# Altium schematic sheet soc.SchDoc
size A3; SheetNumber: 2; SheetTotal: 8
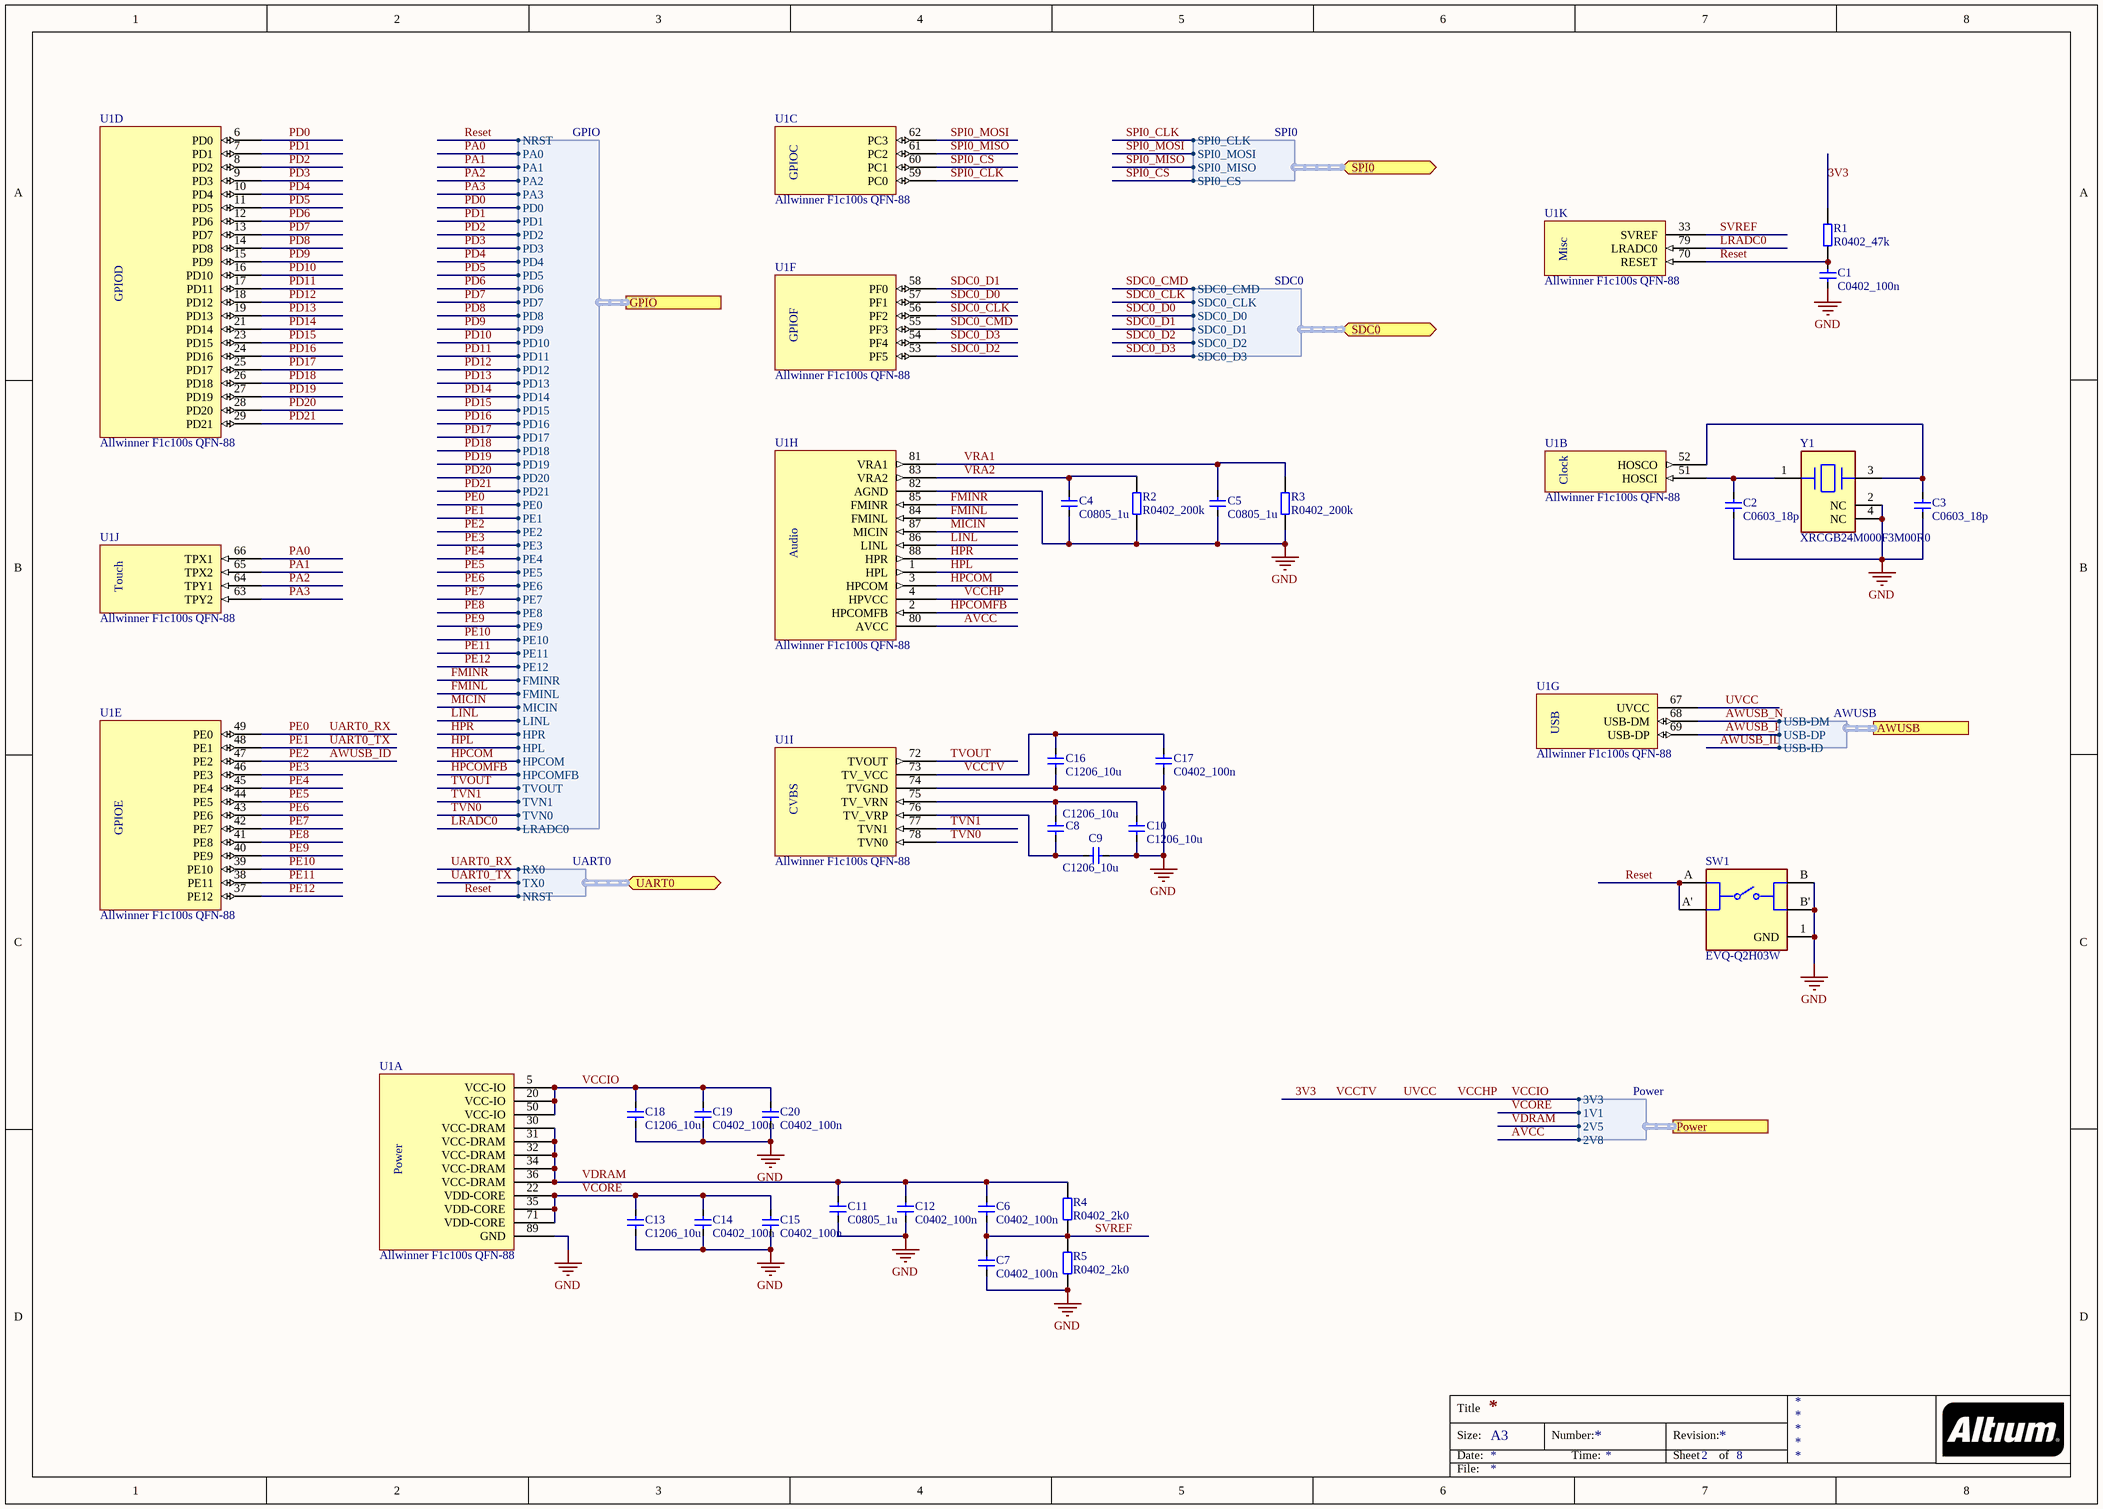
[diagram p0: soc.SchDoc]

## Parts
C1  C0402_100n  [C0402]
C2  C0603_18p  [C0603]
C3  C0603_18p  [C0603]
C4  C0805_1u  [C0805]
C5  C0805_1u  [C0805]
C6  C0402_100n  [C0402]
C7  C0402_100n  [C0402]
C8  C1206_10u  [C1206]
C9  C1206_10u  [C1206]
C10  C1206_10u  [C1206]
C11  C0805_1u  [C0805]
C12  C0402_100n  [C0402]
C13  C1206_10u  [C1206]
C14  C0402_100n  [C0402]
C15  C0402_100n  [C0402]
C16  C1206_10u  [C1206]
C17  C0402_100n  [C0402]
C18  C1206_10u  [C1206]
C19  C0402_100n  [C0402]
C20  C0402_100n  [C0402]
R1  R0402_47k  [R0402]
R2  R0402_200k  [R0402]
R3  R0402_200k  [R0402]
R4  R0402_2k0  [R0402]
R5  R0402_2k0  [R0402]
SW1  EVQ-Q2H03W  [FP-EVQ-Q2H03W-MFG]
U1  Allwinner F1c100s QFN-88  [QFN40P1000X1000X90_HS-89M]  (parts A,B,C,D,E,F,G,H,I,J,K of 11)
Y1  XRCGB24M000F3M00R0  [FP-XRCGB_F_N-MFG]

## Ports
AWUSB (harness AWUSB), GPIO (harness GPIO), Power (harness Power), SDC0 (bidir, harness SDC0), SPI0 (bidir, harness SPI0), UART0 (bidir, harness UART0)

## Harnesses
Power: 3V3, 1V1, 2V5, 2V8
AWUSB: USB-DM, USB-DP, USB-ID
SDC0: SDC0_D0, SDC0_D1, SDC0_D2, SDC0_D3, SDC0_CMD, SDC0_CLK
SPI0: SPI0_CLK, SPI0_MOSI, SPI0_MISO, SPI0_CS
UART0: RX0, TX0, NRST
GPIO: PA0, PA1, PA2, PA3, PD0, PD1, PD2, PD3, PD4, PD5, PD6, PD7, PD8, PD9, PD10, PD11, PD12, PD13, PD14, PD15, PD16, PD17, PD18, PD19, PD20, PD21, PE0, PE1, PE2, PE3, PE4, PE5, PE6, PE7, PE8, PE9, PE10, PE11, PE12, NRST, FMINR, FMINL, MICIN, LINL, HPR, HPL, HPCOM, HPCOMFB, TVOUT, TVN0, TVN1, LRADC0

## Nets
GND: C1.2 C2.2 C3.2 C4.2 C5.2 C7.2 C9.2 C10.2 C11.2 C12.2 C13.2 C14.2 C15.2 C16.2 C17.2 C18.2 C19.2 C20.2 R2.1 R3.1 R5.2 SW1.1(GND) SW1.B SW1.B' U1.74(TVGND) U1.82(AGND) U1.89(GND) Y1.2(NC) Y1.4(NC)
3V3: C16.1 C17.1 C18.1 C19.1 C20.1 R1.2 U1.4(HPVCC) U1.5(VCC-IO) U1.20(VCC-IO) U1.50(VCC-IO) U1.67(UVCC) U1.73(TV_VCC) ; port Power.3V3  [also labelled UVCC, VCCHP, VCCIO, VCCTV]
AVCC: U1.80(AVCC) ; port Power.2V8
AWUSB_ID: U1.47(PE2) ; port AWUSB.USB-ID, port GPIO.PE2  [also labelled PE2]
AWUSB_N: U1.68(USB-DM) ; port AWUSB.USB-DM
AWUSB_P: U1.69(USB-DP) ; port AWUSB.USB-DP
FMINL: U1.84(FMINL) ; port GPIO.FMINL
FMINR: U1.85(FMINR) ; port GPIO.FMINR
HPCOM: U1.3(HPCOM) ; port GPIO.HPCOM
HPCOMFB: U1.2(HPCOMFB) ; port GPIO.HPCOMFB
HPL: U1.1(HPL) ; port GPIO.HPL
HPR: U1.88(HPR) ; port GPIO.HPR
LINL: U1.86(LINL) ; port GPIO.LINL
LRADC0: U1.79(LRADC0) ; port GPIO.LRADC0
MICIN: U1.87(MICIN) ; port GPIO.MICIN
PA0: U1.66(TPX1) ; port GPIO.PA0
PA1: U1.65(TPX2) ; port GPIO.PA1
PA2: U1.64(TPY1) ; port GPIO.PA2
PA3: U1.63(TPY2) ; port GPIO.PA3
PD0: U1.6(PD0) ; port GPIO.PD0
PD1: U1.7(PD1) ; port GPIO.PD1
PD2: U1.8(PD2) ; port GPIO.PD2
PD3: U1.9(PD3) ; port GPIO.PD3
PD4: U1.10(PD4) ; port GPIO.PD4
PD5: U1.11(PD5) ; port GPIO.PD5
PD6: U1.12(PD6) ; port GPIO.PD6
PD7: U1.13(PD7) ; port GPIO.PD7
PD8: U1.14(PD8) ; port GPIO.PD8
PD9: U1.15(PD9) ; port GPIO.PD9
PD10: U1.16(PD10) ; port GPIO.PD10
PD11: U1.17(PD11) ; port GPIO.PD11
PD12: U1.18(PD12) ; port GPIO.PD12
PD13: U1.19(PD13) ; port GPIO.PD13
PD14: U1.21(PD14) ; port GPIO.PD14
PD15: U1.23(PD15) ; port GPIO.PD15
PD16: U1.24(PD16) ; port GPIO.PD16
PD17: U1.25(PD17) ; port GPIO.PD17
PD18: U1.26(PD18) ; port GPIO.PD18
PD19: U1.27(PD19) ; port GPIO.PD19
PD20: U1.28(PD20) ; port GPIO.PD20
PD21: U1.29(PD21) ; port GPIO.PD21
PE0: U1.49(PE0) ; port UART0.RX0, port GPIO.PE0  [also labelled UART0_RX]
PE1: U1.48(PE1) ; port UART0.TX0, port GPIO.PE1  [also labelled UART0_TX]
PE3: U1.46(PE3) ; port GPIO.PE3
PE4: U1.45(PE4) ; port GPIO.PE4
PE5: U1.44(PE5) ; port GPIO.PE5
PE6: U1.43(PE6) ; port GPIO.PE6
PE7: U1.42(PE7) ; port GPIO.PE7
PE8: U1.41(PE8) ; port GPIO.PE8
PE9: U1.40(PE9) ; port GPIO.PE9
PE10: U1.39(PE10) ; port GPIO.PE10
PE11: U1.38(PE11) ; port GPIO.PE11
PE12: U1.37(PE12) ; port GPIO.PE12
Reset: C1.1 R1.1 SW1.A SW1.A' U1.70(RESET) ; port UART0.NRST, port GPIO.NRST
SDC0_CLK: U1.56(PF2) ; port SDC0.SDC0_CLK
SDC0_CMD: U1.55(PF3) ; port SDC0.SDC0_CMD
SDC0_D0: U1.57(PF1) ; port SDC0.SDC0_D0
SDC0_D1: U1.58(PF0) ; port SDC0.SDC0_D1
SDC0_D2: U1.53(PF5) ; port SDC0.SDC0_D2
SDC0_D3: U1.54(PF4) ; port SDC0.SDC0_D3
SPI0_CLK: U1.59(PC0) ; port SPI0.SPI0_CLK
SPI0_CS: U1.60(PC1) ; port SPI0.SPI0_CS
SPI0_MISO: U1.61(PC2) ; port SPI0.SPI0_MISO
SPI0_MOSI: U1.62(PC3) ; port SPI0.SPI0_MOSI
SVREF: C6.2 C7.1 R4.2 R5.1 U1.33(SVREF)
TVN0: U1.78(TVN0) ; port GPIO.TVN0
TVN1: U1.77(TVN1) ; port GPIO.TVN1
TVOUT: U1.72(TVOUT) ; port GPIO.TVOUT
VCORE: C13.1 C14.1 C15.1 U1.22(VDD-CORE) U1.35(VDD-CORE) U1.71(VDD-CORE) ; port Power.1V1
VDRAM: C6.1 C11.1 C12.1 R4.1 U1.30(VCC-DRAM) U1.31(VCC-DRAM) U1.32(VCC-DRAM) U1.34(VCC-DRAM) U1.36(VCC-DRAM) ; port Power.2V5
VRA1: C5.1 R3.2 U1.81(VRA1)
VRA2: C4.1 R2.2 U1.83(VRA2)
NetC2_1: C2.1 U1.51(HOSCI) Y1.1(1_Input/Output)
NetC3_1: C3.1 U1.52(HOSCO) Y1.3(2_Input/Output)
NetC8_1: C8.1 C10.1 U1.75(TV_VRN)
NetC8_2: C8.2 C9.1 U1.76(TV_VRP)

## Notes on the sheet
- Title
- Size:
- Date:
- A3
- Number:
- Time:
- Revision:
- Sheet
- of
- File:
- (in symbol CMP-00002-1, part A) Power
- (in symbol CMP-00002-1, part B) Clock
- (in symbol CMP-00002-1, part C) GPIOC
- (in symbol CMP-00002-1, part D) GPIOD
- (in symbol CMP-00002-1, part E) GPIOE
- (in symbol CMP-00002-1, part F) GPIOF
- (in symbol CMP-00002-1, part G) USB
- (in symbol CMP-00002-1, part H) Audio
- (in symbol CMP-00002-1, part I) CVBS
- (in symbol CMP-00002-1, part J) Touch
- (in symbol CMP-00002-1, part K) Misc

## Library data of the parts
C1 C6 C7 C12 C14 C15 C17 C19 C20 = CMP-003-0006-1: Manufacturer 1: Kemet; Manufacturer Part Number 1: C0402C104K4RACTU; Dielectric: X7R; Voltage Rating DC: 16V; Value: 100n; Tolerance: 0.1%; Part Number: C0402_100n; Pin Count: 2; Component Type: Standard
C2 C3 = CMP-003-0024-1: Manufacturer Part Number 1: C0603C180J1GAC; Manufacturer 1: Kemet; Tolerance: 0.05%; Hidden Value: C180; Voltage Rating DC: 100V; Dielectric: C0G; Value: 18p; Part Number: C0603_18p; Pin Count: 2; Component Type: Standard
C4 C5 C11 = CMP-003-0085-1: Manufacturer 1: Kemet; Manufacturer Part Number 1: C0805C105K3RAC; Voltage Rating DC: 25V; Dielectric: X7R; Hidden Value: C105; Tolerance: 0.1%; Value: 1u; Component Type: Standard; Pin Count: 2; Part Number: C0805_1u
C8-C10 C13 C16 C18 = CMP-003-0097-1: Manufacturer 1: Kemet; Manufacturer Part Number 1: C1206C106K4RAC; Value: 10u; Hidden Value: C106; Tolerance: 0.1%; Dielectric: X7R; Voltage Rating DC: 16V; Part Number: C1206_10u; Pin Count: 2; Component Type: Standard
R1 = CMP-004-0459-1: Manufacturer Part Number 1: CRCW040247K0FKED; Manufacturer 1: Vishay; Power Rating: 62,5mW; Tolerance: 1%; Value: 47k; Part Number: R0402_47k; Component Type: Standard; Pin Count: 2
R2 R3 = CMP-004-0474-1: Manufacturer Part Number 1: CRCW0402200KFKED; Manufacturer 1: Vishay; Tolerance: 1%; Power Rating: 62,5mW; Value: 200k; Pin Count: 2; Component Type: Standard; Part Number: R0402_200k
R4 R5 = CMP-004-0426-1: Manufacturer 1: Vishay; Manufacturer Part Number 1: CRCW04022K00FKED; Tolerance: 1%; Power Rating: 62,5mW; Value: 2k0; Component Type: Standard; Pin Count: 2; Part Number: R0402_2k0
SW1 = CMP-05618-000002-1: SWITCH TACTILE SPST-NO 0.02A 15V; Manufacturer: Panasonic Electronic Components; Electromechanical Life: 1000000Cycles; Contact Current Rating: 20mA; Contact Resistance: 100mΩ; Operating Force: 1N; Height: 3.3mm; ComponentLink2URL: https://industrial.panasonic.com/ac/cdn/e/control/switch/light-touch/catalog/sw_lt_eng_6s_th.pdf; Category: Switch; Mouser Description: Switch Tactile ON OFF SPST Round Button J-Bend 0.02A 15VDC 1N SMD Embossed T/R; Mount: Surface Mount; Temperature: -40°C to +85°C; Throw Configuration: SPST-NO; Digikey Description: SWITCH TACTILE SPST-NO 0.02A 15V; Device Class L1: Electromechanical; ComponentLink2Description: Datasheet; Manufacturer Part Number: EVQ-Q2H03W; Device Class L3: Tactile Switches; RoHS: TRUE; Device Class L2: Switches; Temperature Range High: +85°C; Temperature Range Low: -40°C; Octopart: https://octopart.com/evq-q2h03w-panasonic-1368538; Voltage Rating Dc: 15V; Package: 0; Automotive: No; Lead Free: Yes
U1 = CMP-00002-1
Y1 = CMP-06054-000017-1: CRYSTAL 24.0000MHZ 6PF SMD; ESR (Equivalent Series Resistance): 150R; Operating Frequency: 24 MHz; Tolerance: 30ppm; Frequency: 24MHz; Frequency Stability: 40ppm; Length: 2mm; Height: 0.028inch; Lead Free: Lead Free; Min Operating Temperature: -30°C; REACH SVHC: No SVHC; RoHS Compliant: Yes; Series Resistance: 150R; Mount: Surface Mount; Packaging: Tape and Reel; Termination: SMD/SMT; Case/Package: SMD/SMT; Max Operating Temperature: 85°C; Width: 1.6mm; Number of Pins: 4; Load Capacitance: 6pF; Package Quantity: 1; Depth: 1.6mm; Frequency Tolerance: 30ppm; Series: XRCGB